# EAGLE design LaborUSB (EAGLE 6.5.0)
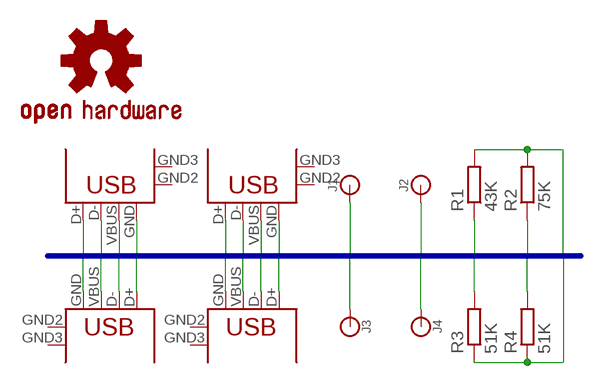
[diagram p0: schematic, sheet 1]

## Parts
J1  BANANA  [BANANA]
J2  BANANA  [BANANA]
J3  BANANA  [BANANA]
J4  BANANA  [BANANA]
LOGO1  OSHW-LOGOM  [OSHW-LOGO-M]
R1  43K  R-EU_R0805  [R0805]
R2  75K  R-EU_R0805  [R0805]
R3  51K  R-EU_R0805  [R0805]
R4  51K  R-EU_R0805  [R0805]
USB1  USB+SHIELD  [USB-A-VERTICAL]
USB2  USB+SHIELD  [USB-A-VERTICAL]
USB3  USB+SHIELD  [USB-A-VERTICAL]
USB4  USB+SHIELD  [USB-A-VERTICAL]

## Nets
D+: R2.1 R4.2 USB1.D+ USB2.D+ USB3.D+ USB4.D+
D-: R1.1 R3.2 USB1.D- USB2.D- USB3.D- USB4.D-
GND: J1.P$1 J2.P$1 R3.1 R4.1 USB1.GND USB2.GND USB3.GND USB4.GND
VBUS: J3.P$1 J4.P$1 R1.2 R2.2 USB1.VBUS USB2.VBUS USB3.VBUS USB4.VBUS
Unconnected: USB1.GND2 USB1.GND3 USB2.GND2 USB2.GND3 USB3.GND2 USB3.GND3 USB4.GND2 USB4.GND3

## Buses
VBUS,GND,D+,D-

## Library data of the parts
J1-J4 = LaborUSB:BANANA: Through-hole banana jack
LOGO1 = SparkFun-Aesthetics:OSHW-LOGO: Open Source Hardware Logo This logo indicates the piece of hardware it is found on incorporates a OSHW license and/or adheres to the definition of open source hardware found here: http://freedomdefined.org/OSHW
R1-R4 = resistor:R-EU_: RESISTOR, European symbol
USB1-USB4 = LaborUSB:USB+SHIELD: USB+Shield USB connector with shield pins connectable

## Board
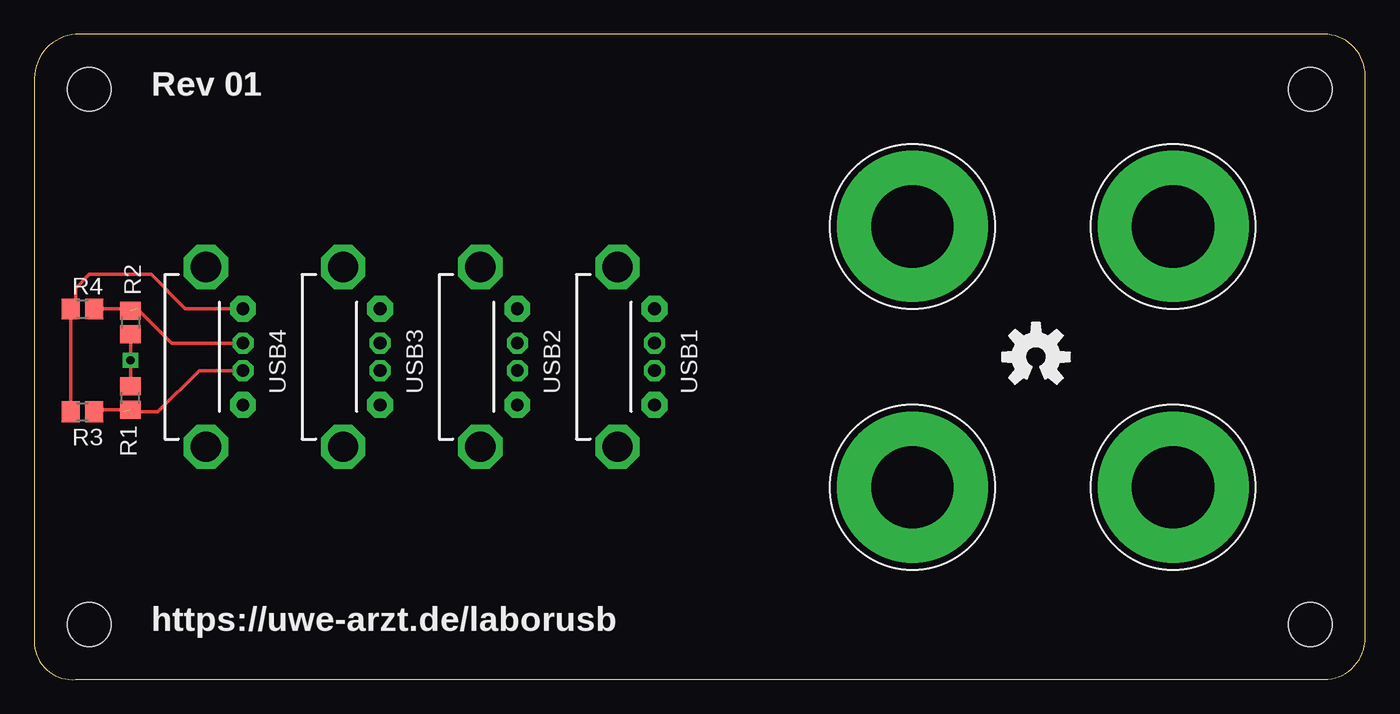
[diagram p1: board, top side]
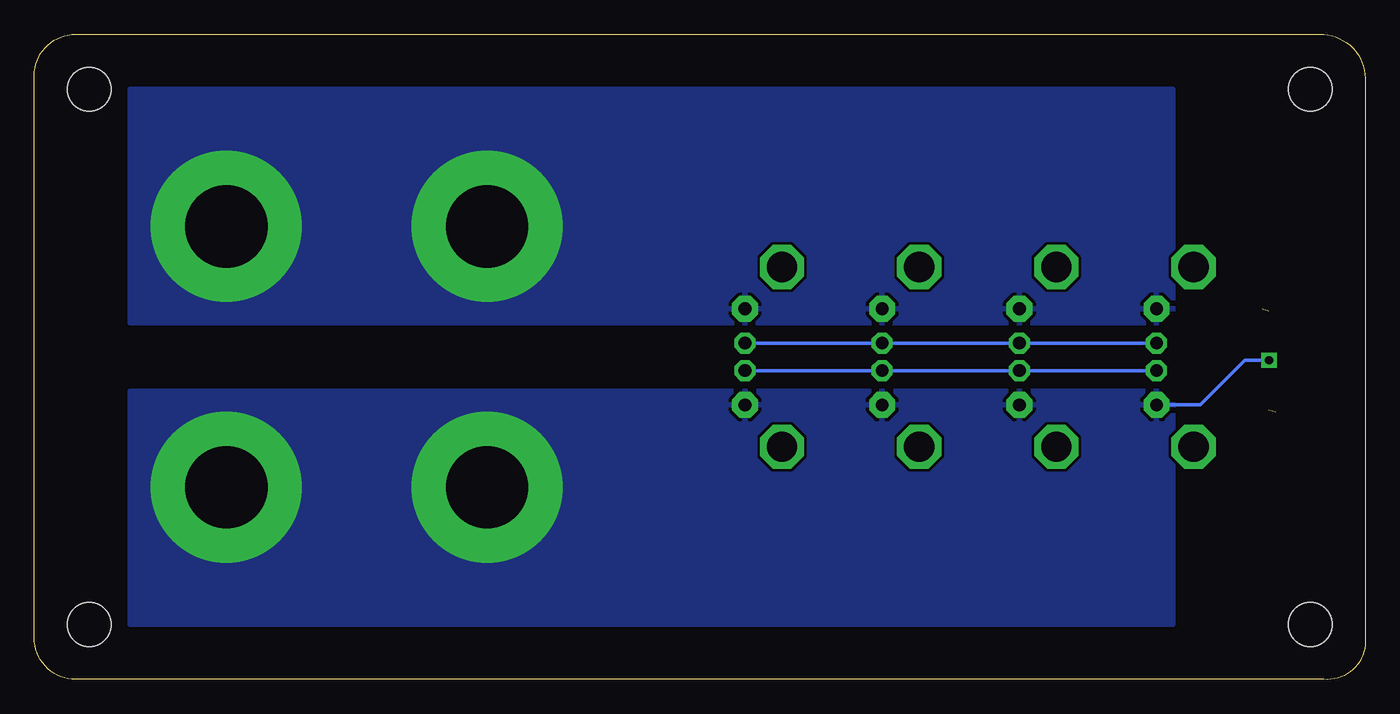
[diagram p2: board, bottom side, seen from below]

Size 97.01 x 47.01 mm. Coordinates in mm from the lower left corner, seen from the top.
Outline: 3.01,0.01 94.01,0.01 arc90 97.01,3.01 97.01,44.01 arc90 94.01,47.01 3.01,47.01 arc90 0.01,43.51 0.01,2.51 arc90 3.01,0.01
Copper layers (1*16): Top 0.035mm / dielectric 1.5mm / Bottom 0.035mm
Design rules "SparkFun": minimum track width 8mil, minimum drill 20mil, track to track 8mil, track to pad 8mil, pad to pad 8mil, via to via 8mil, smd to smd 8mil, copper to edge 8mil, drill to drill 8mil, minimum pad ring 12mil, minimum via ring 10mil, stop-mask expansion 4mil, vias tented up to drill 20mil, thermal gap 10mil
Holes 3.2 mm at 4.01,4.01 4.01,43.01 93.01,4.01 93.01,43.01

### Footprints (pad centres in the part's own frame; a part is rotated, then mirrored left to right if it is on the bottom)
BANANA = drill 6 pad 11: P$1 0,0
R0805 = smd 1.3 x 1.5: 1 -0.85,0; 2 0.85,0
USB-A-VERTICAL = drill 0.92 octagon: D+ 2.7,1; D- 2.7,-1 | drill 0.92 pad 1.88 octagon: GND 2.7,3.5; VBUS 2.7,-3.5 | drill 2.2 octagon: GND2 0,-6.55; GND3 0,6.55

### Placement (x,y rotation side)
J1  64.01,33.01 0 top
J2  83.01,33.01 0 top
J3  64.01,14.01 0 top
J4  83.01,14.01 0 top
LOGO1  73.01,23.51 0 top
R1  7.01,20.51 90 top
R2  7.01,26.01 270 top
R3  3.51,19.51 0 top
R4  3.51,27.01 0 top
USB1  42.51,23.51 0 top
USB2  32.51,23.51 0 top
USB3  22.51,23.51 0 top
USB4  12.51,23.51 0 top

### Tracks (layer width: path | path; a pad name or v marks a point on that pad's centre or on a via)
D+  (1 unrouted)
  Top 0.254: USB4.D+ 10.01,24.51 7.51,27.01 R4.2
  Bottom 0.254: USB1.D+ USB2.D+ USB3.D+ USB4.D+
D-  (1 unrouted)
  Top 0.254: USB4.D- 12.01,22.51 9.01,19.51 6.51,19.51 | R1.1 5.01,19.66 R3.2
  Bottom 0.254: USB1.D- USB2.D- USB3.D- USB4.D-
GND
  Top 0.254: R3.1 R4.1 3.01,27.36 3.01,28.51 4.01,29.51 8.51,29.51 11.01,27.01 USB4.GND
  pour Bottom: 14.01,26.01 90.01,26.01 90.01,43.01 14.01,43.01
VBUS  (via drill 0.6)
  Top 0.254: R2.2 v7.01,23.26 R1.2
  Bottom 0.254: USB4.VBUS 12.01,20.01 8.76,23.26 v7.01,23.26
  pour Bottom: 14.01,21.01 90.01,21.01 90.01,4.01 14.01,4.01

### Text on the board
tPlace: Rev 01 | https://uwe-arzt.de/laborusb